# EAGLE schematic servo-controller (EAGLE 6.5.0)
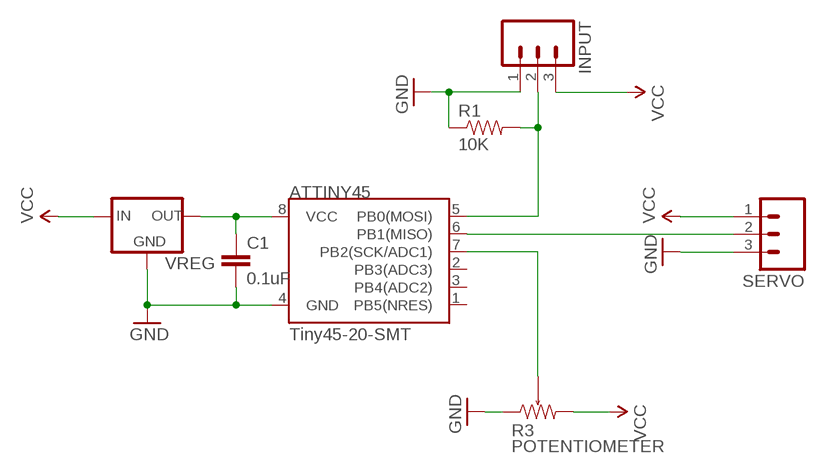
[diagram p0: schematic, sheet 1]

## Parts
ATTINY45  Tiny45-20-SMT  ATTINY45TINY45-20-SMT  [SO08-EIAJ]
C1  0.1uF  0.1UF-25V-5%(0603)  [0603-CAP]
INPUT  M03PTH  [1X03]
R1  10K  10KOHM-1/10W-1%(0603)0603  [0603-RES]
R3  POTENTIOMETER  [0603-ARV]
SERVO  M03PTH  [1X03]
VREG  V_REG_78XX-TO-220  [TO-220-ALT]

## Nets
GND: ATTINY45.4(GND) C1.2 INPUT.1 R1.1 R3.1 SERVO.3 VREG.GND
N$1: ATTINY45.5(PB0(MOSI)) INPUT.2 R1.2
N$2: ATTINY45.8(VCC) C1.1 VREG.OUT
N$3: ATTINY45.6(PB1(MISO)) SERVO.2
N$4: ATTINY45.7(PB2(SCK/ADC1)) R3.3 R3.4 R3.5 R3.6 R3.7 R3.8
VCC: INPUT.3 R3.2 SERVO.1 VREG.IN
Unconnected: ATTINY45.1(PB5(NRES)) ATTINY45.2(PB3(ADC3)) ATTINY45.3(PB4(ADC2))

## Library data of the parts
ATTINY45 = SparkFun-DigitalIC:ATTINY45: Atmel 8-pin 2/4/8kB flash uC; PROD_ID: IC-08922
C1 = SparkFun-Capacitors:0.1UF-25V-5%(0603): CAP-08604; PROD_ID: CAP-08604
INPUT SERVO = SparkFun-Connectors:M03: Header 3 Standard 3-pin 0.1" header. Use with straight break away headers (SKU : PRT-00116), right angle break away headers (PRT-00553), swiss pins (PRT-00743), machine pins (PRT-00117), and female headers (PRT-00115). Molex polarized connector foot print use with SKU : PRT-08232 with associated crimp pins and housings.
R1 = SparkFun-Resistors:10KOHM-1/10W-1%(0603): RES-00824; PROD_ID: RES-00824
R3 = SparkFun-Passives:POTENTIOMETER
VREG = SparkFun-PowerIC:V_REG_78XX: Voltage Regulator Standard 78xx regulator. IGO (Input Ground Output). Spark Fun Electronics SKU : COM-00107; PROD_ID: VREG-08450; SF_ID: COM-00107